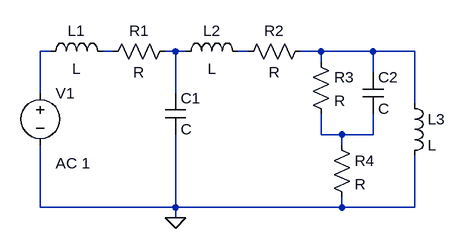
[diagram p0: schematic EA_EX5_Silenciador.asc]
EA_EX5_Silenciador.asc, the LTspice schematic file:
Version 4
SHEET 1 880 680
WIRE -48 64 -64 64
WIRE 48 64 32 64
WIRE 144 64 128 64
WIRE 160 64 144 64
WIRE 256 64 240 64
WIRE 368 64 336 64
WIRE 448 64 368 64
WIRE 512 64 448 64
WIRE 368 80 368 64
WIRE 448 96 448 64
WIRE -64 128 -64 64
WIRE 144 128 144 64
WIRE 512 144 512 64
WIRE 368 192 368 160
WIRE 400 192 368 192
WIRE 448 192 448 160
WIRE 448 192 400 192
WIRE 400 208 400 192
WIRE -64 304 -64 208
WIRE 144 304 144 192
WIRE 144 304 -64 304
WIRE 400 304 400 288
WIRE 400 304 144 304
WIRE 512 304 512 224
WIRE 512 304 400 304
WIRE 144 320 144 304
FLAG 144 320 0
SYMBOL voltage -64 112 R0
WINDOW 123 24 124 Left 2
WINDOW 39 0 0 Left 0
SYMATTR InstName V1
SYMATTR Value ""
SYMATTR Value2 AC 1
SYMBOL ind -64 80 R270
WINDOW 0 32 56 VTop 2
WINDOW 3 5 56 VBottom 2
SYMATTR InstName L1
SYMBOL res 144 48 R90
WINDOW 0 0 56 VBottom 2
WINDOW 3 32 56 VTop 2
SYMATTR InstName R1
SYMBOL cap 128 128 R0
SYMATTR InstName C1
SYMBOL ind 144 80 R270
WINDOW 0 32 56 VTop 2
WINDOW 3 5 56 VBottom 2
SYMATTR InstName L2
SYMBOL res 352 48 R90
WINDOW 0 0 56 VBottom 2
WINDOW 3 32 56 VTop 2
SYMATTR InstName R2
SYMBOL res 352 64 R0
SYMATTR InstName R3
SYMBOL res 384 192 R0
SYMATTR InstName R4
SYMBOL cap 432 96 R0
SYMATTR InstName C2
SYMBOL ind 496 128 R0
SYMATTR InstName L3

The netlist it stands for:
* EA_EX5_Silenciador.asc
V1 N001 0 AC 1
L1 N001 N002 L
R1 N003 N002 R
C1 N003 0 C
L2 N003 N004 L
R2 N005 N004 R
R3 N005 N006 R
R4 N006 0 R
C2 N005 N006 C
L3 N005 0 L
.backanno
.end